# EAGLE design SkyKontrol-slotExpansion (EAGLE 9.5.2)
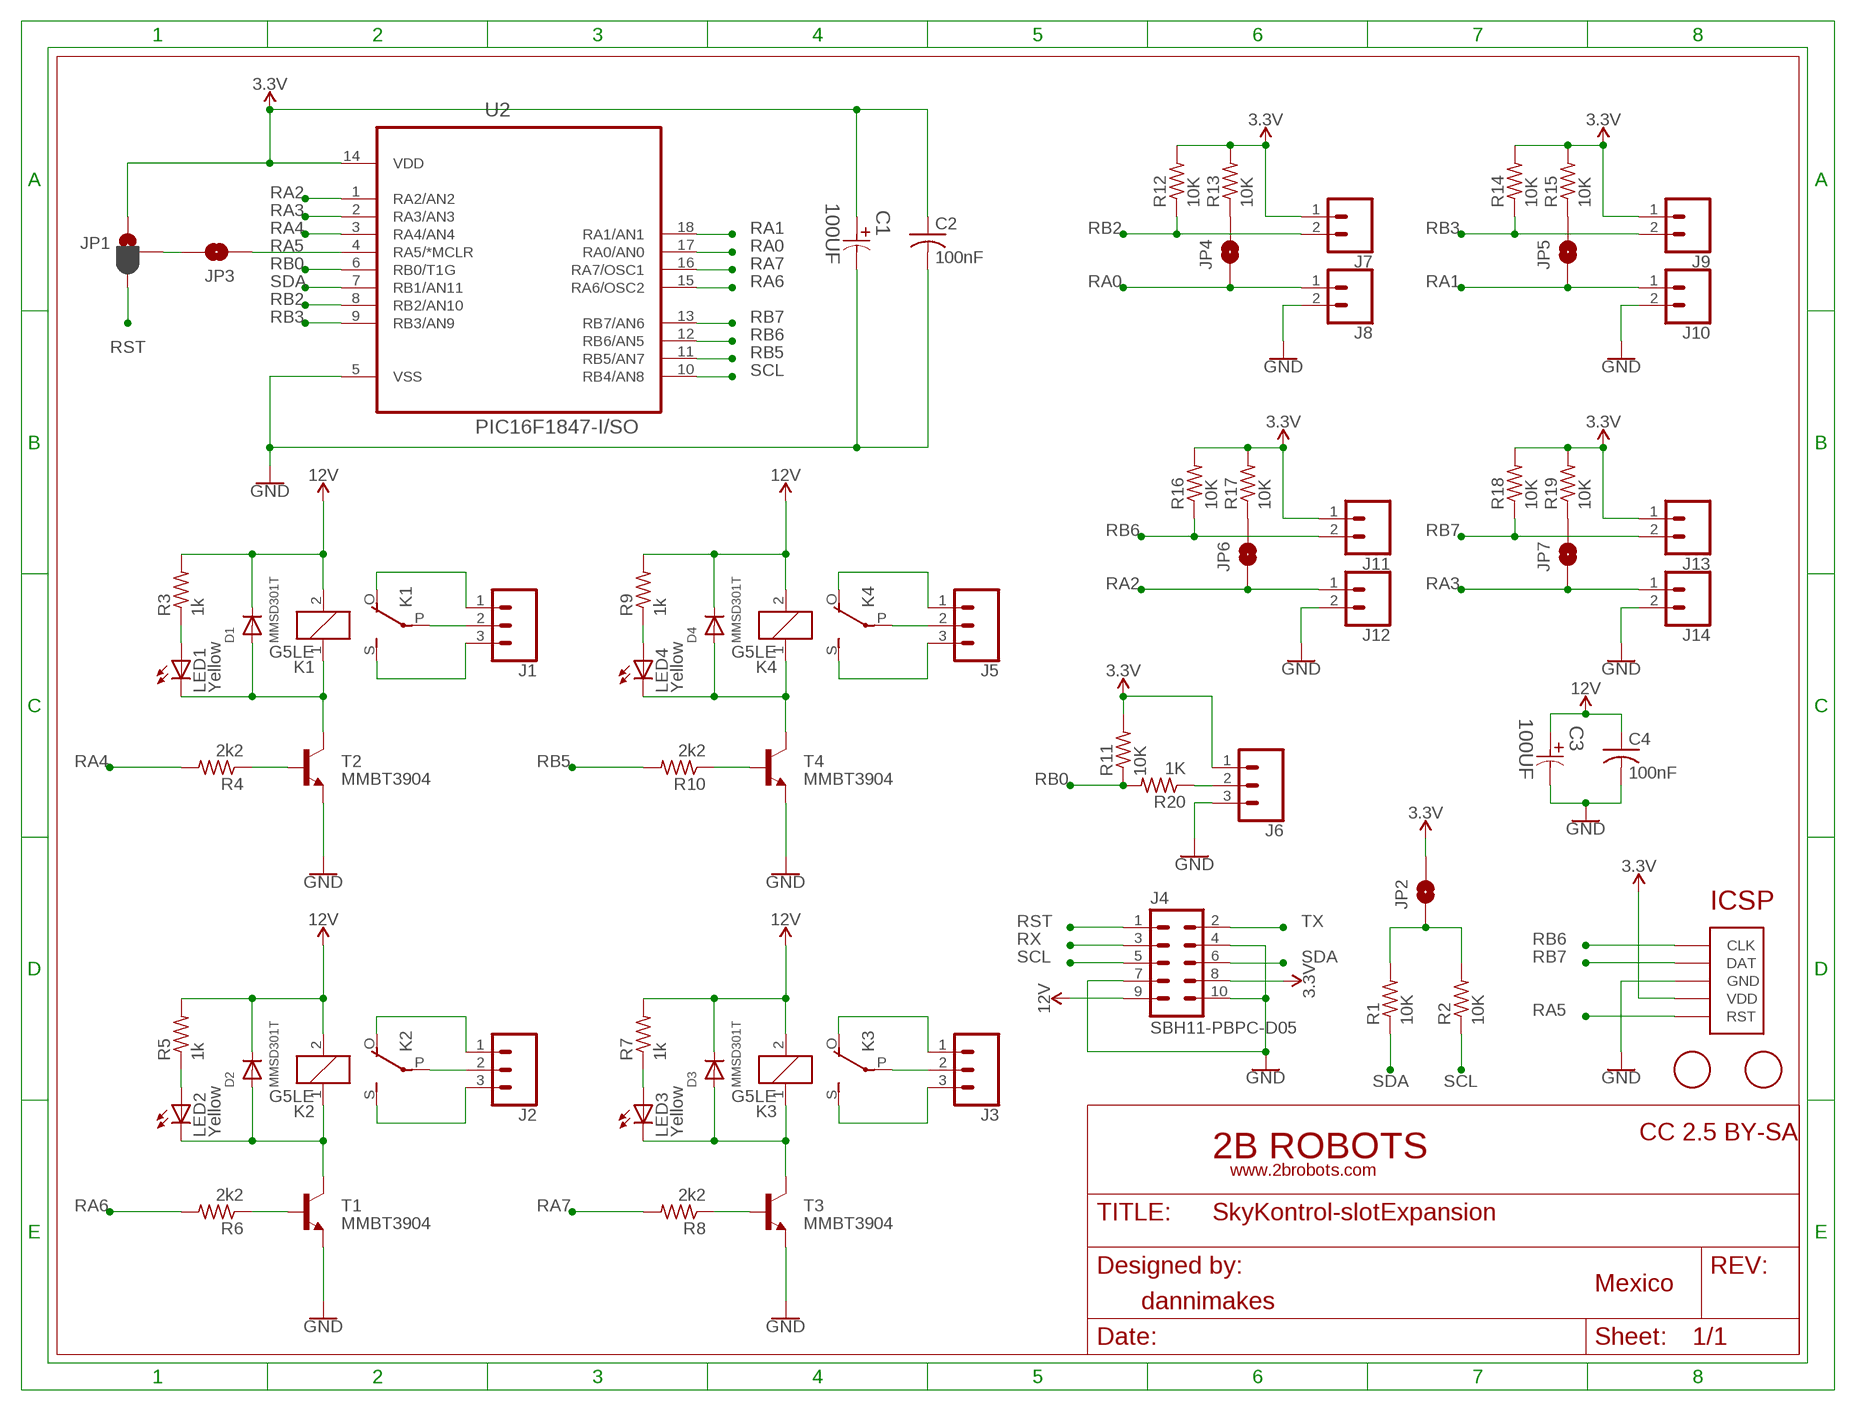
[diagram p0: schematic, sheet 1]

## Parts
C1  100UF  EEE-HA1E101XP-CASE-D8  [CAPAE660X800N]
C2  100nF  C-USC0603K  [C0603K]
C3  100UF  EEE-HA1E101XP-CASE-D8  [CAPAE660X800N]
C4  100nF  C-USC0603K  [C0603K]
D1  MMSD301T  DIODESOD-123  [SOD-123]
D2  MMSD301T  DIODESOD-123  [SOD-123]
D3  MMSD301T  DIODESOD-123  [SOD-123]
D4  MMSD301T  DIODESOD-123  [SOD-123]
J1  CONN_03-SCREW-5MM  [SCREWTERMINAL-5MM-3]
J2  CONN_03-SCREW-5MM  [SCREWTERMINAL-5MM-3]
J3  CONN_03-SCREW-5MM  [SCREWTERMINAL-5MM-3]
J4  SBH11-PBPC-D05  [SBH11-PBPC-D05]
J5  CONN_03-SCREW-5MM  [SCREWTERMINAL-5MM-3]
J6  CONN_03-SCREW-5MM  [SCREWTERMINAL-5MM-3]
J7  CONN_025MM  [SCREWTERMINAL-5MM-2]
J8  CONN_025MM  [SCREWTERMINAL-5MM-2]
J9  CONN_025MM  [SCREWTERMINAL-5MM-2]
J10  CONN_025MM  [SCREWTERMINAL-5MM-2]
J11  CONN_025MM  [SCREWTERMINAL-5MM-2]
J12  CONN_025MM  [SCREWTERMINAL-5MM-2]
J13  CONN_025MM  [SCREWTERMINAL-5MM-2]
J14  CONN_025MM  [SCREWTERMINAL-5MM-2]
JP1  JUMPER-SMT_3_1-NC_PASTE_SILK  [SMT-JUMPER_3_1-NC_PASTE_SILK]
JP2  JUMPER-SMT_2_NO_SILK  [SMT-JUMPER_2_NO_SILK]
JP3  JUMPER-SMT_2_NO_SILK  [SMT-JUMPER_2_NO_SILK]
JP4  JUMPER-SMT_2_NO_SILK  [SMT-JUMPER_2_NO_SILK]
JP5  JUMPER-SMT_2_NO_SILK  [SMT-JUMPER_2_NO_SILK]
JP6  JUMPER-SMT_2_NO_SILK  [SMT-JUMPER_2_NO_SILK]
JP7  JUMPER-SMT_2_NO_SILK  [SMT-JUMPER_2_NO_SILK]
K1  G5LE  [G5LE]
K2  G5LE  [G5LE]
K3  G5LE  [G5LE]
K4  G5LE  [G5LE]
LED1  Yellow  LEDCHIPLED_1206  [CHIPLED_1206]
LED2  Yellow  LEDCHIPLED_1206  [CHIPLED_1206]
LED3  Yellow  LEDCHIPLED_1206  [CHIPLED_1206]
LED4  Yellow  LEDCHIPLED_1206  [CHIPLED_1206]
R1  10K  R-US_R0805  [R0805]
R2  10K  R-US_R0805  [R0805]
R3  1k  R-US_R0805  [R0805]
R4  2k2  R-US_R0805  [R0805]
R5  1k  R-US_R0805  [R0805]
R6  2k2  R-US_R0805  [R0805]
R7  1k  R-US_R0805  [R0805]
R8  2k2  R-US_R0805  [R0805]
R9  1k  R-US_R0805  [R0805]
R10  2k2  R-US_R0805  [R0805]
R11  10K  R-US_R0805  [R0805]
R12  10K  R-US_R0805  [R0805]
R13  10K  R-US_R0805  [R0805]
R14  10K  R-US_R0805  [R0805]
R15  10K  R-US_R0805  [R0805]
R16  10K  R-US_R0805  [R0805]
R17  10K  R-US_R0805  [R0805]
R18  10K  R-US_R0805  [R0805]
R19  10K  R-US_R0805  [R0805]
R20  1K  R-US_R0805  [R0805]
T1  MMBT3904  MMBT3904LT1-NPN-SOT23-BEC  [SOT23-BEC]
T2  MMBT3904  MMBT3904LT1-NPN-SOT23-BEC  [SOT23-BEC]
T3  MMBT3904  MMBT3904LT1-NPN-SOT23-BEC  [SOT23-BEC]
T4  MMBT3904  MMBT3904LT1-NPN-SOT23-BEC  [SOT23-BEC]
U2  PIC16F1847-I/SO  [SOIC127P1030X265-18N]
U$1  FIDUCIAL  [FIDUCIAL_1MM]
U$2  ICSP_POGO  [ICSP_POGO]
U$3  FIDUCIAL  [FIDUCIAL_1MM]

## Nets
3.3V: C1.1 C2.1 J4.8 J6.1 J7.1 J9.1 J11.1 J13.1 JP1.1 JP2.2 R11.2 R12.2 R13.2 R14.2 R15.2 R16.2 R17.2 R18.2 R19.2 U2.14(VDD) U$2.P$2(VDD)
12V: C3.1 C4.1 D1.C D2.C D3.C D4.C J4.9 K1.2 K2.2 K3.2 K4.2 R3.2 R5.2 R7.2 R9.2
GND: C1.2 C2.2 C3.2 C4.2 J4.4 J4.7 J4.10 J6.3 J8.2 J10.2 J12.2 J14.2 T1.E T2.E T3.E T4.E U2.5(VSS) U$2.P$3(GND)
N$1: JP1.2 JP3.2
N$2: J1.2 K1.P(2:P)
N$3: J1.3 K1.S(2:S)
N$4: J1.1 K1.O(2:O)
N$8: JP2.1 R1.2 R2.2
N$9: D1.A K1.1 LED1.C T2.C
N$10: J2.2 K2.P(2:P)
N$12: J2.3 K2.S(2:S)
N$13: LED1.A R3.1
N$14: R4.1 T2.B
N$15: J6.2 R20.1
N$16: J2.1 K2.O(2:O)
N$17: D2.A K2.1 LED2.C T1.C
N$18: LED2.A R5.1
N$19: R6.1 T1.B
N$21: J3.2 K3.P(2:P)
N$22: J3.3 K3.S(2:S)
N$23: J3.1 K3.O(2:O)
N$24: D3.A K3.1 LED3.C T3.C
N$25: LED3.A R7.1
N$26: R8.1 T3.B
N$28: J5.2 K4.P(2:P)
N$29: J5.3 K4.S(2:S)
N$30: J5.1 K4.O(2:O)
N$31: D4.A K4.1 LED4.C T4.C
N$32: LED4.A R9.1
N$33: R10.1 T4.B
N$37: JP4.2 R13.1
N$39: JP5.2 R15.1
N$40: JP6.2 R17.1
N$41: JP7.2 R19.1
RA0: J8.1 JP4.1 U2.17(RA0/AN0)
RA1: J10.1 JP5.1 U2.18(RA1/AN1)
RA2: J12.1 JP6.1 U2.1(RA2/AN2)
RA3: J14.1 JP7.1 U2.2(RA3/AN3)
RA4: R4.2 U2.3(RA4/AN4)
RA5: JP3.1 U2.4(RA5/*MCLR) U$2.P$1(RST)
RA6: R6.2 U2.15(RA6/OSC2)
RA7: R8.2 U2.16(RA7/OSC1)
RB0: R11.1 R20.2 U2.6(RB0/T1G)
RB2: J7.2 R12.1 U2.8(RB2/AN10)
RB3: J9.2 R14.1 U2.9(RB3/AN9)
RB5: R10.2 U2.11(RB5/AN7)
RB6: J11.2 R16.1 U2.12(RB6/AN5) U$2.P$5(CLK)
RB7: J13.2 R18.1 U2.13(RB7/AN6) U$2.P$4(DAT)
RST: J4.1 JP1.3
RX: J4.3
SCL: J4.5 R2.1 U2.10(RB4/AN8)
SDA: J4.6 R1.1 U2.7(RB1/AN11)
TX: J4.2

## Library data of the parts
C1 C3 = Panasonic-EEEFT_EEEH:EEE-: Aluminum Electrolytic Capacitors,Surface Mount Type; MPN: EEE-HA1E101XP; OC_FARNELL: 1973328; OC_NEWARK: 58T9236; PACKAGE: CASE-D8; SUPPLIER: PANASONIC; TOLERANCE: ±20 %; VOLTAGERATING: 25V
C2 C4 = adafruit:C-US: CAPACITOR, American symbol
D1-D4 = adafruit:DIODE: Diode SMADIODE - SMA Surface Mount Package 20V 1A Schottky Diode Digikey: 641-1014-6-ND DO-1N4148 - Through Hole Small Current Diode SOD-123 20V 1 A (.5mV Vf) Schottky Diode - Digikey: MBRX120TPMSCT-ND SOD-323 10V 570mA (.38mV Vf, 3ns) Schottky Diode - Digikey: ZLLS410CT-ND SOD-523 30V 30mA Schottky Diode (RB751S-40TE61) - Digikey: RB751S-40TE61CT-ND SOT23-R/W - SOT23 Package (R = Solder Paste/Reflow Ovens, W = Hand-Soldering) BAT54Film 40V 300mA - Digikey: 497-7162-1-ND
J1-J3 J5 J6 = SparkFun-Connectors:CONN_03: Multi connection point. Often used as Generic Header-pin footprint for 0.1 inch spaced/style header connections On any of the 0.1 inch spaced packages, you can populate with these: Break Away Headers - Straight <https://www.sparkfun.com/products/116> (PRT-00116) Break Away Male Headers - Right Angle <https://www.sparkfun.com/products/553> (PRT-00553) Female Headers <https://www.sparkfun.com/products/115> (PRT-00115) Break Away Headers - Machine Pin <https://www.sparkfun.com/products/117> (PRT-00117) Break Away Female Headers - Swiss Machine Pin <https://www.sparkfun.com/products/743> (PRT-00743) Stackable Header - 3 Pin (Female, 0.1") <https://www.sparkfun.com/products/13875> (PRT-13875) For SCREWTERMINALS and SPRING TERMINALS visit here: Screw Terimnals on SparkFun.com <https://www.sparkfun.com/search/results?term=Screw+Terminals> (5mm/3.5mm/2.54mm spacing) This device is also useful as a general connection point to wire up your design to another part of your project. Our various solder wires solder well into these plated through hole pads. Hook-Up Wire - Assortment (Stranded, 22 AWG) <https://www.sparkfun.com/products/11375> (PRT-11375) Hook-Up Wire - Assortment (Solid Core, 22 AWG) <https://www.sparkfun.com/products/11367> (PRT-11367) View the entire wire category on our website here <https://www.sparkfun.com/categories/141> Special notes: Molex polarized connector foot print use with SKU : PRT-08232 with associated crimp pins and housings.; PROD_ID: CONN-10134; SF_SKU: PRT-08433
J4 = con-sullins:SBH11-PBPC-D05: HEADER - Vertical, Shrouded
J7-J14 = SparkFun-Connectors:CONN_02: Multi connection point. Often used as Generic Header-pin footprint for 0.1 inch spaced/style header connections On any of the 0.1 inch spaced packages, you can populate with these: Break Away Headers - Straight <https://www.sparkfun.com/products/116> (PRT-00116) Break Away Male Headers - Right Angle <https://www.sparkfun.com/products/553> (PRT-00553) Female Headers <https://www.sparkfun.com/products/115> (PRT-00115) Break Away Headers - Machine Pin <https://www.sparkfun.com/products/117> (PRT-00117) Break Away Female Headers - Swiss Machine Pin <https://www.sparkfun.com/products/743> (PRT-00743) For SCREWTERMINALS and SPRING TERMINALS visit here: Screw Terimnals on SparkFun.com <https://www.sparkfun.com/search/results?term=Screw+Terminals> (5mm/3.5mm/2.54mm spacing) This device is also useful as a general connection point to wire up your design to another part of your project. Our various solder wires solder well into these plated through hole pads. Hook-Up Wire - Assortment (Stranded, 22 AWG) <https://www.sparkfun.com/products/11375> (PRT-11375) Hook-Up Wire - Assortment (Solid Core, 22 AWG) <https://www.sparkfun.com/products/11367> (PRT-11367) View the entire wire category on our website here <https://www.sparkfun.com/categories/141> Special notes: Molex polarized connector foot print use with: PRT-08233 with associated crimp pins and housings. 2.54_SCREWTERM for use with PRT-10571. 3.5mm Screw Terminal footprints for PRT-08084 5mm Screw Terminal footprints for use with PRT-08432; SF_SKU: PRT-08432
JP1 = SparkFun-Jumpers:JUMPER-SMT_3_1-NC_PASTE: Normally closed solder jumper (1 of 2 connections) This jumper has an aperture in the stencil to allow solder paste to bridge one of the two connections. One connection is normally closed (NC), while the other is normally open (NO). Wick off the solder to open the connection. Reapply solder to reclose the connection. Apply solder to the other side instead to change the current path.
JP2-JP7 = SparkFun-Jumpers:JUMPER-SMT_2_NO: Normally open jumper This jumper has two pads in close proximity to each other. Apply solder to close the connection. Round pads are easier to solder for beginners, but are a lot larger. SparkFun Product that uses the round pads: SparkFun EL Sequencer <https://www.sparkfun.com/products/12781>
K1-K4 = relay:G5LE: RELAY 1 x switch, 10 A/120 V AC, 8 A/30 V DC, Omron; OC_FARNELL: unknown; OC_NEWARK: unknown
LED1-LED4 = adafruit:LED: LED OSRAM: - CHIPLED LG R971, LG N971, LY N971, LG Q971, LY Q971, LO R971, LY R971 LH N974, LH R974 LS Q976, LO Q976, LY Q976 LO Q996 - Hyper CHIPLED LW Q18S LB Q993, LB Q99A, LB R99A - SideLED LS A670, LO A670, LY A670, LG A670, LP A670 LB A673, LV A673, LT A673, LW A673 LH A674 LY A675 LS A676, LA A676, LO A676, LY A676, LW A676 LS A679, LY A679, LG A679 - Hyper Micro SIDELED® LS Y876, LA Y876, LO Y876, LY Y876 LT Y87S - SmartLED LW L88C, LW L88S LB L89C, LB L89S, LG L890 LS L89K, LO L89K, LY L89K LS L896, LA L896, LO L896, LY L896 - TOPLED LS T670, LO T670, LY T670, LG T670, LP T670 LSG T670, LSP T670, LSY T670, LOP T670, LYG T670 LG T671, LOG T671, LSG T671 LB T673, LV T673, LT T673, LW T673 LH T674 LS T676, LA T676, LO T676, LY T676, LB T676, LH T676, LSB T676, LW T676 LB T67C, LV T67C, LT T67C, LS T67K, LO T67K, LY T67K, LW E67C LS E67B, LA E67B, LO E67B, LY E67B, LB E67C, LV E67C, LT E67C LW T67C LS T679, LY T679, LG T679 LS T770, LO T770, LY T770, LG T770, LP T770 LB T773, LV T773, LT T773, LW T773 LH T774 LS E675, LA E675, LY E675, LS T675 LS T776, LA T776, LO T776, LY T776, LB T776 LHGB T686 LT T68C, LB T68C - Hyper Mini TOPLED® LB M676 - Mini TOPLED Santana® LG M470 LS M47K, LO M47K, LY M47K Source: http://www.osram.convergy.de/
R1-R20 = adafruit:R-US_: RESISTOR, American symbol
T1-T4 = transistor:*-NPN-: NPN Transistror BF959 corrected 2008.03.06
U2 = PIC 16F1847:PIC16F1847-I/SO: IC, 18 Pin Flash Microcontrollers with XLP Technology-SOIC-18; MPN: PIC16F1847-I/SO; OC_FARNELL: 1971870; OC_NEWARK: 23T3107; PACKAGE: SOIC-18; SUPPLIER: Microchip
U$1 U$3 = adafruit:FIDUCIAL: For use by pick and place machines to calibrate the vision/machine, 1mm By microbuilder.eu
U$2 = ICSP_POGO:ICSP_POGO

## Board
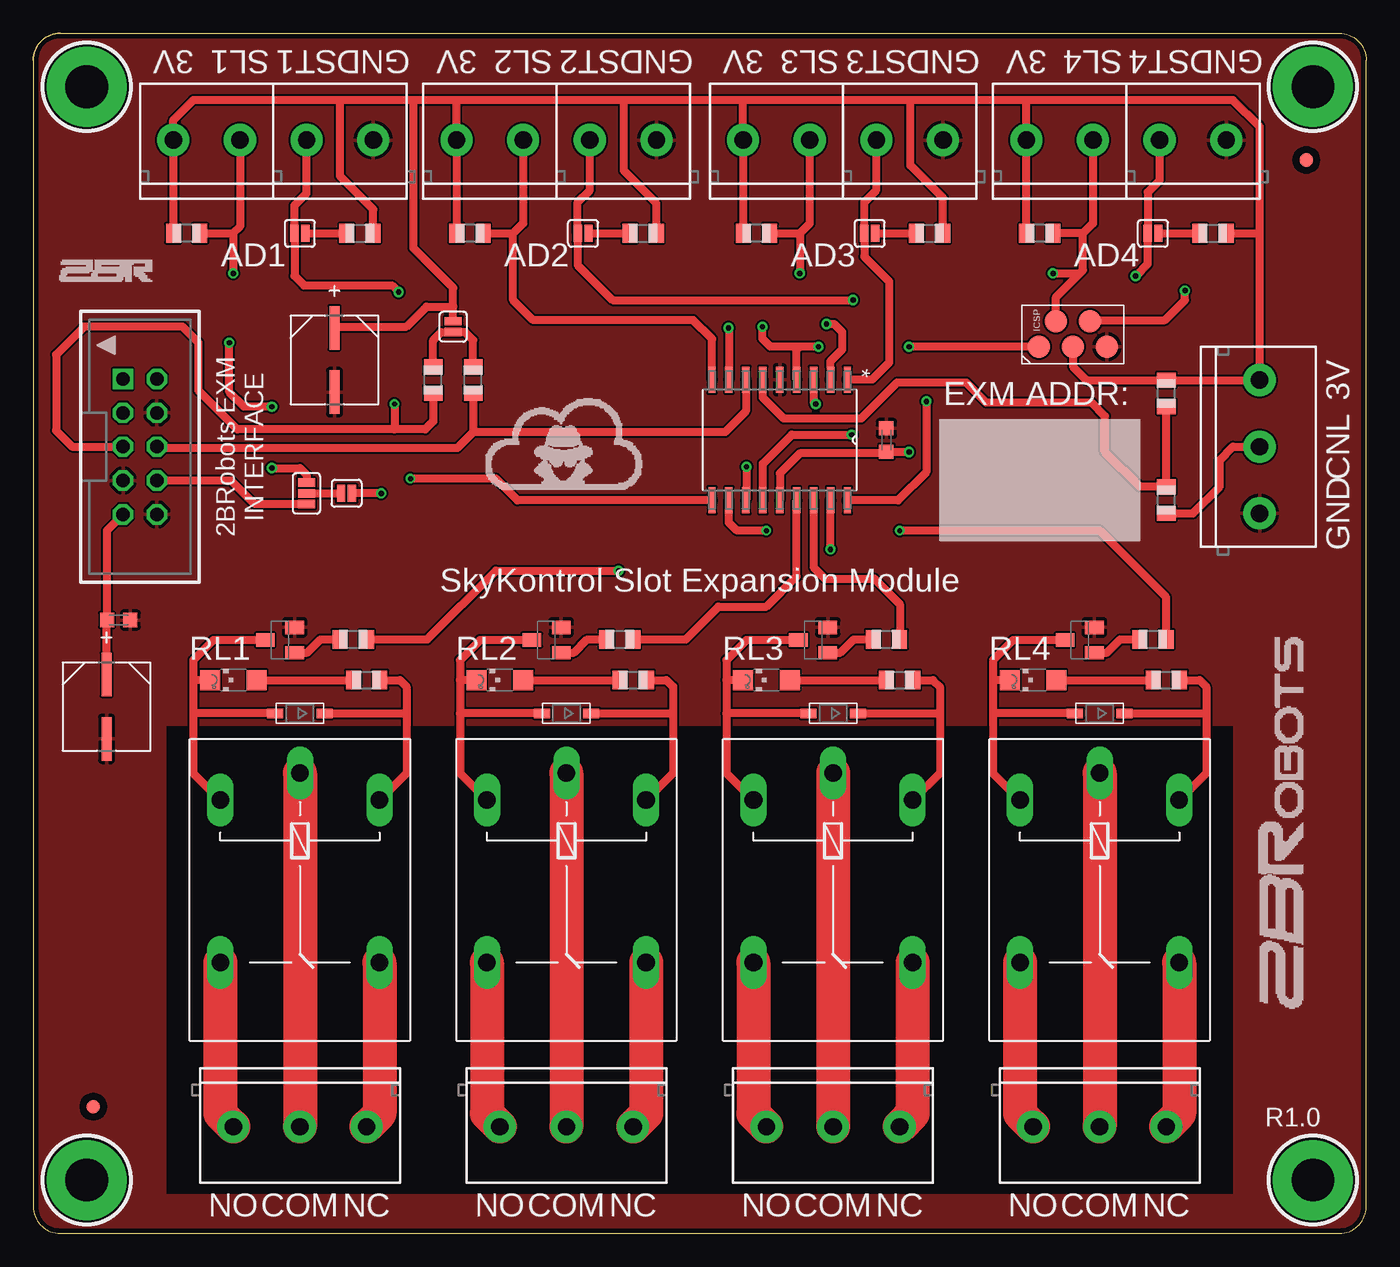
[diagram p1: board, top side]
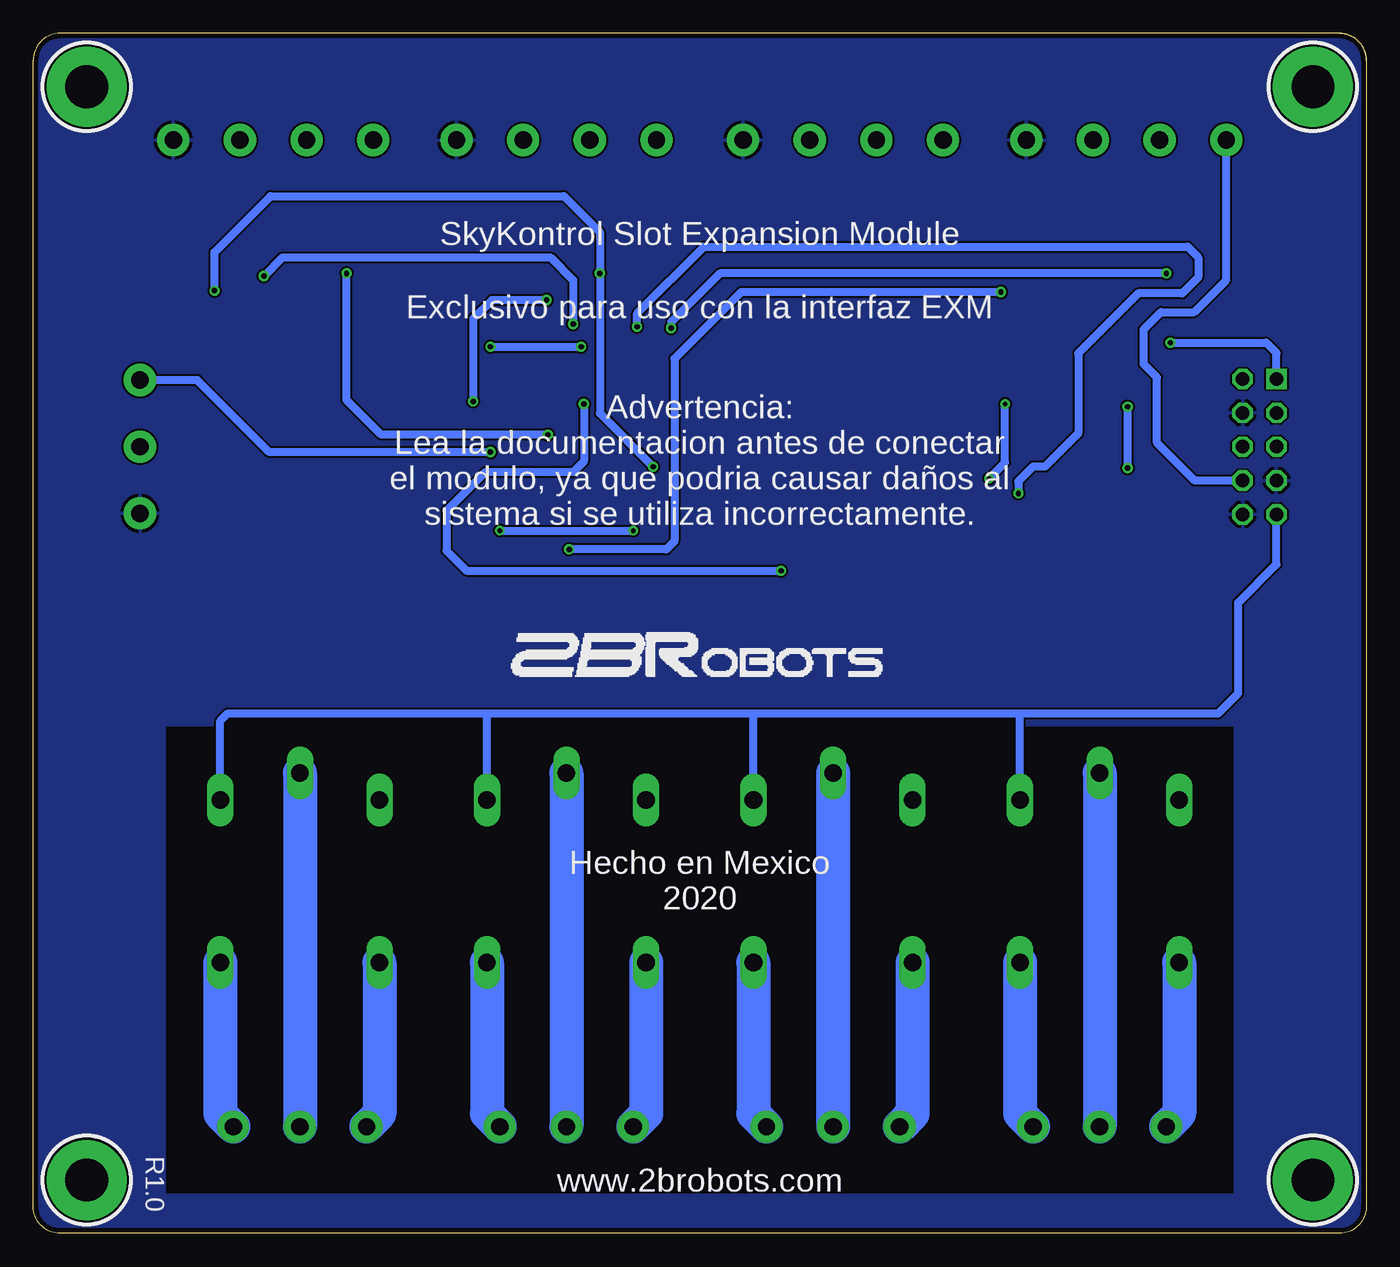
[diagram p2: board, bottom side, seen from below]

Size 100 x 90 mm. Coordinates in mm from the lower left corner, seen from the top.
Outline: 0,88 0,2 arc90 2,0 98,0 arc90 100,2 100,88 arc90 98,90 2,90
Outline: 2,90 arc90 0,88
Outline: 0,88 arc-90 2,90
Copper layers (1*16): Top 0.0356mm / dielectric 1.5011mm / Bottom 0.0356mm
Design rules "2brobots-2layer": minimum track width 6mil, minimum drill 0.3mm, track to track 6mil, track to pad 6mil, pad to pad 6mil, via to via 6mil, smd to smd 6mil, copper to edge 15mil, drill to drill 6mil, minimum pad ring 7mil, minimum via ring 7mil, stop-mask expansion 2.5mil, vias tented up to drill 50mil, thermal gap 10mil
tRestrict: 4 lines
bRestrict: 4 lines

### Footprints (pad centres in the part's own frame; a part is rotated, then mirrored left to right if it is on the bottom)
CAPAE660X800N = smd 3.251 x 0.762: 1 -2.413,0; 2 2.413,0
C0603K = smd 1.05 x 1.08: 1 -0.875,0; 2 0.875,0
SOD-123 = smd 1.2 x 0.7: A 1.85,0; C -1.85,0
SCREWTERMINAL-5MM-3 = drill 1.3 pad 2.413: 1 -5,0; 2 0,0; 3 5,0
SBH11-PBPC-D05 = drill 1.016 square: 1 -5.08,-1.27 | drill 1.016 octagon: 2 -5.08,1.27; 3 -2.54,-1.27; 4 -2.54,1.27; 5 0,-1.27; 6 0,1.27; 7 2.54,-1.27; 8 2.54,1.27; 9 5.08,-1.27; 10 5.08,1.27
SCREWTERMINAL-5MM-2 = drill 1.3 pad 2.413: 1 -2.5,0; 2 2.5,0
SMT-JUMPER_3_1-NC_PASTE_SILK = smd 0.635 x 1.27: 1 -0.813,0; 2 0,0; 3 0.813,0
SMT-JUMPER_2_NO_SILK = smd 0.635 x 1.27: 1 -0.406,0; 2 0.406,0
G5LE = drill 1.321 long: 1 -7.493,-5.969; 2 -7.493,5.969; O 4.699,5.969; P -9.525,0; S 4.699,-5.969
CHIPLED_1206 = smd 1.5 x 1.5: A 0,-1.75; C 0,1.75
R0805 = smd 1.1 x 1.4: 1 -1,0; 2 1,0
SOT23-BEC = smd 1 x 1.4: B -0.95,-1.1; C 0,1.1; E 0.95,-1.1
SOIC127P1030X265-18N = smd 1.981 x 0.559: 1 -4.521,5.08; 2 -4.521,3.81; 3 -4.521,2.54; 4 -4.521,1.27; 5 -4.521,0; 6 -4.521,-1.27; 7 -4.521,-2.54; 8 -4.521,-3.81; 9 -4.521,-5.08; 10 4.521,-5.08; 11 4.521,-3.81; 12 4.521,-2.54; 13 4.521,-1.27; 14 4.521,0; 15 4.521,1.27; 16 4.521,2.54; 17 4.521,3.81; 18 4.521,5.08
FIDUCIAL_1MM = smd 1 x 1: 1 0,0
ICSP_POGO = smd 1.7 x 1.7: P$1 -2.55,0; P$2 0,0; P$3 2.55,0; P$4 -1.275,1.9; P$5 1.275,1.9

### Placement (x,y rotation side)
C1  22.6,65.5 270 top
C2  64,59.5 90 top
C3  5.5,39.5 270 top
C4  6.4,46 0 top
D1  20,39 180 top
D2  40,39 180 top
D3  60,39 180 top
D4  80,39 180 top
J1  20,8 180 top
J2  40,8 180 top
J3  60,8 180 top
J4  8,59 270 top
J5  80,8 180 top
J6  92,59 270 top
J7  13,82 0 top
J8  23,82 0 top
J9  34.25,82 0 top
J10  44.25,82 0 top
J11  55.75,82 0 top
J12  65.75,82 0 top
J13  77,82 0 top
J14  87,82 0 top
JP1  20.5,55.5 90 top
JP2  31.5,68 90 top
JP3  23.5,55.5 180 top
JP4  20,75 0 top
JP5  41.25,75 0 top
JP6  62.75,75 0 top
JP7  84,75 0 top
K1  20,25 270 top
K2  40,25 270 top
K3  60,25 270 top
K4  80,25 270 top
LED1  15,41.5 90 top
LED2  35,41.5 90 top
LED3  55,41.5 90 top
LED4  75,41.5 90 top
R1  33,64 90 top
R2  30,64 90 top
R3  25,41.5 0 top
R4  24,44.55 0 top
R5  45,41.5 0 top
R6  44,44.55 0 top
R7  65,41.5 0 top
R8  64,44.55 0 top
R9  85,41.5 0 top
R10  84,44.55 0 top
R11  85,63 90 top
R12  11.5,75 180 top
R13  24.5,75 0 top
R14  32.75,75 180 top
R15  45.75,75 0 top
R16  54.25,75 180 top
R17  67.25,75 0 top
R18  75.5,75 180 top
R19  88.5,75 0 top
R20  85,55 90 top
T1  38.5,44.5 90 top
T2  18.5,44.5 90 top
T3  58.5,44.5 90 top
T4  78.5,44.5 90 top
U2  56,59.5 270 top
U$1  4.5,9.5 0 top
U$2  78,66.5 0 top
U$3  95.5,80.5 0 top

### Tracks (layer width: path | path; a pad name or v marks a point on that pad's centre or on a via)
3.3V  (via drill 0.4)
  Top 0.61: R12.2 J7.1 10.5,83.5 12,85 23.1,85 | R14.2 J9.1 31.75,85 | R16.2 J11.1 53.25,85 | R18.2 J13.1 74.5,85 | 74.5,85 90,85 92,83 92,75 | 74.5,85 65.8,85 | 65.8,85 53.25,85 | 53.25,85 44.3,85 | 44.3,85 31.75,85 | 31.75,85 28.5,85 | 28.5,85 23.1,85 | 92,75 J6.1 R11.2 79,64 78,65 U$2.P$2 | R19.2 92,75 | 28.5,85 28.5,73.9 31.5,70.9 31.5,69.5 | JP2.2 31.5,69.5 | C1.1 22.69,68 28,68 29.5,69.5 31.5,69.5 | U2.14 56,57 57.5,58.5 63.88,58.5 C2.1 65.67,58.62 v65.7,58.6 | R13.2 25.5,76.8 23,79.3 23,84.9 23.1,85 | R15.2 46.75,77.25 44.3,79.7 44.3,85 | R17.2 68.25,77.65 65.8,80.1 65.8,85 | JP1.1 16.61,54.69 14.84,56.46 J4.8
  Bottom 0.61: J4.8 12.86,56.46 15.7,59.3 15.7,64.2 16.7,65.2 16.7,67.8 15.4,69.1 12.9,69.1 10.5,71.5 J7.1 | v65.7,58.6 82.3,58.6 87.7,64 J6.1
12V
  Top 0.61: R3.2 27.5,41.5 28,41 28,39 | K1.2 28,34.52 28,39 | D1.C 28,39 | R5.2 47.5,41.5 48,41 48,39 | 48,39 48,34.52 K2.2 | D2.C 48,39 | R7.2 67.5,41.5 68,41 68,39 | 68,39 68,34.52 K3.2 | D3.C 68,39 | R9.2 87.5,41.5 88,41 88,39 | 88,39 88,34.52 K4.2 | D4.C 88,39 | C3.1 5.5,45.98 C4.1 5.53,52.72 J4.9
  Bottom 0.61: K4.2 85.97,38.43 85.4,39 65.9,39 | 65.9,39 45.9,39 | 45.9,39 26.1,39 | 26.1,39 11.1,39 9.6,40.5 9.6,47.3 6.73,50.17 J4.9 | K1.2 25.97,38.87 26.1,39 | K2.2 45.97,38.93 45.9,39 | K3.2 65.97,38.93 65.9,39
GND
  pour Top: 0,0 100,0 100,90 0,90
  pour Bottom: 0,0 100,0 100,90 0,90
N$1
  Top 0.61: JP1.2 JP3.2
N$2
  Top 2.54: K1.P J1.2
  Bottom 2.54: K1.P J1.2
N$3
  Top 2.54: K1.S 14.03,8.97 J1.3
  Bottom 2.54: K1.S 14.03,8.97 J1.3
N$4
  Top 2.54: K1.O 25.97,8.97 J1.1
  Bottom 2.54: K1.O 25.97,8.97 J1.1
N$5  (via drill 3.2 pad 6)
  other vias: 96,86
N$6  (via drill 3.2 pad 6)
  other vias: 4,86
N$7  (via drill 3.2 pad 6)
  other vias: 4,4
N$8
  Top 0.61: R2.2 30,67 30.59,67.59 JP2.1 32.41,67.59 33,67 R1.2
N$9
  Top 0.61: T2.C 13.5,44.5 12,43 12,41.5 | K1.1 12,34.52 12,39 | 12,41.5 12,39 | D1.A 12,39 | LED1.C 12,41.5
N$10
  Top 2.54: K2.P J2.2
  Bottom 2.54: K2.P J2.2
N$11  (via drill 3.2 pad 6)
  other vias: 96,4
N$12
  Top 2.54: K2.S 34.03,8.97 J2.3
  Bottom 2.54: K2.S 34.03,8.97 J2.3
N$13
  Top 0.61: LED1.A R3.1
N$14
  Top 0.61: T2.B 20.55,43.55 21.55,44.55 R4.1
N$15
  Top 0.61: R20.1 87,54 89,56 89,58 90,59 J6.2
N$16
  Top 2.54: K2.O 45.97,8.97 J2.1
  Bottom 2.54: K2.O 45.97,8.97 J2.1
N$17
  Top 0.61: T1.C 33.5,44.5 32,43 32,41.5 | K2.1 32,34.52 32,39 | 32,41.5 32,39 | D2.A 32,39 | LED2.C 32,41.5
N$18
  Top 0.61: LED2.A R5.1
N$19
  Top 0.61: T1.B 40.55,43.55 41.55,44.55 R6.1
N$21
  Top 2.54: K3.P J3.2
  Bottom 2.54: K3.P J3.2
N$22
  Top 2.54: K3.S 54.03,8.97 J3.3
  Bottom 2.54: K3.S 54.03,8.97 J3.3
N$23
  Top 2.54: K3.O 65.97,8.97 J3.1
  Bottom 2.54: K3.O 65.97,8.97 J3.1
N$24
  Top 0.61: T3.C 53.5,44.5 52,43 52,41.5 | K3.1 52,34.52 52,39 | 52,41.5 52,39 | D3.A 52,39 | LED3.C 52,41.5
N$25
  Top 0.61: LED3.A R7.1
N$26
  Top 0.61: T3.B 60.55,43.55 61.55,44.55 R8.1
N$28
  Top 2.54: K4.P J5.2
  Bottom 2.54: K4.P J5.2
N$29
  Top 2.54: K4.S 74.03,8.97 J5.3
  Bottom 2.54: K4.S 74.03,8.97 J5.3
N$30
  Top 2.54: K4.O 85.97,8.97 J5.1
  Bottom 2.54: K4.O 85.97,8.97 J5.1
N$31
  Top 0.61: T4.C 73.5,44.5 72,43 72,41.5 | K4.1 72,34.52 72,39 | 72,41.5 72,39 | D4.A 72,39 | LED4.C 72,41.5
N$32
  Top 0.61: LED4.A R9.1
N$33
  Top 0.61: T4.B 80.55,43.55 81.55,44.55 R10.1
N$37
  Top 0.61: JP4.2 22,75 R13.1
N$39
  Top 0.61: JP5.2 R15.1
N$40
  Top 0.61: JP6.2 R17.1
N$41
  Top 0.61: JP7.2 R19.1
RA0  (via drill 0.4)
  Top 0.61: J8.1 20.5,78 19.59,77.09 JP4.1 19.59,71.81 20.3,71.1 26.9,71.1 v27.4,70.6 | v59.8,51.3 U2.17
  Bottom 0.61: v27.4,70.6 46.9,70.6 51.9,65.6 51.9,51.9 52.5,51.3 v59.8,51.3
RA1  (via drill 0.4)
  Top 0.61: J10.1 41.75,78.25 40.84,77.34 JP5.1 40.84,72.61 43.46,70 v61.5,70 | v67,62.4 67,57.1 64.88,54.98 U2.18
  Bottom 0.61: v61.5,70 65.6,70 67,68.6 v67,62.4
RA2
  Top 0.61: J12.1 63.25,78.25 62.34,77.34 JP6.1 62.34,73.26 64.2,71.4 64.2,65.3 62.92,64.02 U2.1
RA3  (via drill 0.4)
  Top 0.61: J14.1 84.5,79 83.6,78.1 JP7.1 83.59,72.69 v82.7,71.8 | v59.5,68.2 60.1,68.2 60.7,67.6 60.7,66.3 59.8,65.4 59.8,65 59.8,64.03 U2.2
  Bottom 0.61: v82.7,71.8 81.3,73.2 61.2,73.2 59.5,71.5 v59.5,68.2
RA4  (via drill 0.4)
  Top 0.61: R4.2 29.55,44.55 34.7,49.7 v43.9,49.7 | U2.3 58.54,62.36 v58.7,62.2
  Bottom 0.61: v58.7,62.2 58.7,57.9 59.5,57.1 66.1,57.1 69,54.2 69,51.2 67.5,49.7 v43.9,49.7
RA5  (via drill 0.4)
  Top 0.61: U$2.P$1 v65.7,66.5 | v58.9,66.5 57.5,66.5 | 57.5,66.5 55.3,66.5 54.7,67.1 v54.7,68 | U2.4 57.27,66.27 57.5,66.5 | v26.1,55.5 JP3.1
  Bottom 0.61: v65.7,66.5 v58.9,66.5 | v54.7,68 54.7,69 49.7,74 13.4,74 12.6,73.2 12.6,71.7 13.8,70.5 17.1,70.5 21.6,66 21.6,60 24.1,57.5 25,57.5 26.1,56.4 v26.1,55.5
RA6
  Top 0.61: R6.2 48.95,44.55 51.4,47 55,47 57.27,49.27 U2.15
RA7
  Top 0.61: U2.16 58.54,49.96 59.4,49.1 63.1,49.1 65,47.2 R8.2
RB0
  Top 0.61: R11.1 R20.2 83,56 80.4,58.6 80.4,61.3 79.4,62.3 71.5,62.3 70,63.8 64.8,63.8 62.1,61.1 56.3,61.1 54.73,62.67 U2.6
RB2  (via drill 0.4)
  Top 0.61: J7.2 15.5,75.5 15,75 | R12.1 15,75 | 15,75 v15,72 | v52.15,67.9 52.19,67.86 U2.8
  Bottom 0.61: v15,72 48.5,72 52.15,68.35 v52.15,67.9
RB3
  Top 0.61: J9.2 36.75,75.75 36,75 | R14.1 36,75 | U2.9 50.92,67.08 49.5,68.5 37.5,68.5 36,70 36,75
RB5  (via drill 0.35)
  Top 0.61: R10.2 85,47.7 80,52.7 v65,52.7 | v55,52.7 52.8,52.7 52.19,53.31 U2.11
  Bottom 0.61: v65,52.7 v55,52.7
RB6  (via drill 0.4)
  Top 0.61: R16.1 57.5,75 | 57.5,75 58.25,75.75 J11.2 | 57.5,75 v57.5,72 | v53.5,57.5 53.5,55.02 U2.12 | U$2.P$5 79.38,68.5 84.9,68.5 86.4,70 v86.4,70.7
  Bottom 0.61: v53.5,57.5 57.5,61.5 v57.5,72 57.5,75.1 60.2,77.8 82.2,77.8 86.4,73.6 v86.4,70.7
RB7  (via drill 0.4)
  Top 0.61: J13.2 79.5,75.75 78.75,75 | 78.75,75 R18.1 | U$2.P$4 76.72,70.22 78.5,72 | 78.75,75 78.75,72.25 78.5,72 | U2.13 54.73,57.73 56.9,59.9 v61.4,59.9 | v76.5,72 78.5,72
  Bottom 0.61: v61.4,59.9 73.9,59.9 76.5,62.5 v76.5,72
RST  (via drill 0.4)
  Top 0.61: v17.9,57.4 20,57.4 20.5,56.9 JP1.3 | v17.9,62 15.8,62 14.7,63.1 v14.7,66.8
  Bottom 0.61: J4.1 6.73,66.03 7.5,66.8 v14.7,66.8 | v17.9,57.4 v17.9,62
SCL  (via drill 0.35)
  Top 0.61: R2.1 30,60.9 29.4,60.3 27.1,60.3 | J4.5 2.9,59 1.7,60.2 1.7,65.9 3.8,68 11.2,68 12.4,66.8 12.4,63.2 15.3,60.3 27.1,60.3 | U2.10 36.32,54.98 34.7,56.6 v28.3,56.6 | v27.1,62.2 27.1,60.3
  Bottom 0.61: v28.3,56.6 27.1,57.8 v27.1,62.2
SDA
  Top 0.61: R1.1 33,60.1 | 33,60.1 31.8,58.9 9.37,58.9 J4.6 | U2.7 53.46,61.66 51.9,60.1 33,60.1

### Text on the board
tPlace: 3V | SL1 | ST1 | GND | 3V | SL2 | ST2 | GND | 3V | SL3 | ST3 | GND | 3V | SL4 | ST4 | GND | AD1 | AD2 | AD3 | AD4 | 3V | EXM ADDR: | 2BRobots EXM / INTERFACE | CNL | GND | SkyKontrol Slot Expansion Module | RL1 | RL2 | RL3 | RL4 | R1.0 | NO | COM | NC | NO | COM | NC | NO | COM | NC | NO | COM | NC
bPlace: SkyKontrol Slot Expansion Module | Exclusivo para uso con la interfaz EXM | Advertencia: / Lea la documentacion antes de conectar / el modulo, ya que podria causar daños al / sistema si se utiliza incorrectamente. | Hecho en Mexico / 2020 | www.2brobots.com | R1.0
tStop: www.2brobots.com | @dannimakes